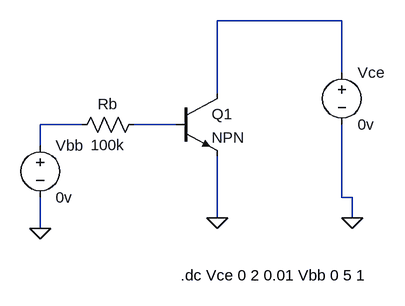
[diagram p0: schematic Draft4.asc]
Draft4.asc, the LTspice schematic file:
Version 4
SHEET 1 880 680
WIRE 368 0 176 0
WIRE 368 80 368 0
WIRE 176 112 176 0
WIRE -32 160 -96 160
WIRE 112 160 48 160
WIRE -96 192 -96 160
WIRE 368 272 368 160
WIRE 384 272 368 272
WIRE 176 304 176 208
WIRE 384 304 384 272
WIRE -96 320 -96 272
FLAG -96 320 0
FLAG 176 304 0
FLAG 384 304 0
SYMBOL npn 112 112 R0
SYMATTR InstName Q1
SYMBOL voltage -96 176 R0
SYMATTR InstName Vbb
SYMATTR Value 0v
SYMBOL voltage 368 64 R0
SYMATTR InstName Vce
SYMATTR Value 0v
SYMBOL res 64 144 R90
WINDOW 0 0 56 VBottom 2
WINDOW 3 32 56 VTop 2
SYMATTR InstName Rb
SYMATTR Value 100k
TEXT 120 392 Left 2 !.dc Vce 0 2 0.01 Vbb 0 5 1

The netlist it stands for:
* Draft4.asc
Q1 N001 N003 0 0 NPN
Vbb N002 0 0v
Vce N001 0 0v
Rb N003 N002 100k
.model NPN NPN
.model PNP PNP
.lib standard.bjt
.dc Vce 0 2 0.01 Vbb 0 5 1
.backanno
.end